# EasyEDA schematic SCH_PDWD-MINI R2_2022-02-19.json

## Sheets
1 PDWD-MINI-SCH_Sheet1_R2: TITLE: PDWD-MINI; REV: 2.0; Date: 2022-02-13; Sheet: 1/2; Drawn By: Dddienst; Company: DienstNet LLC
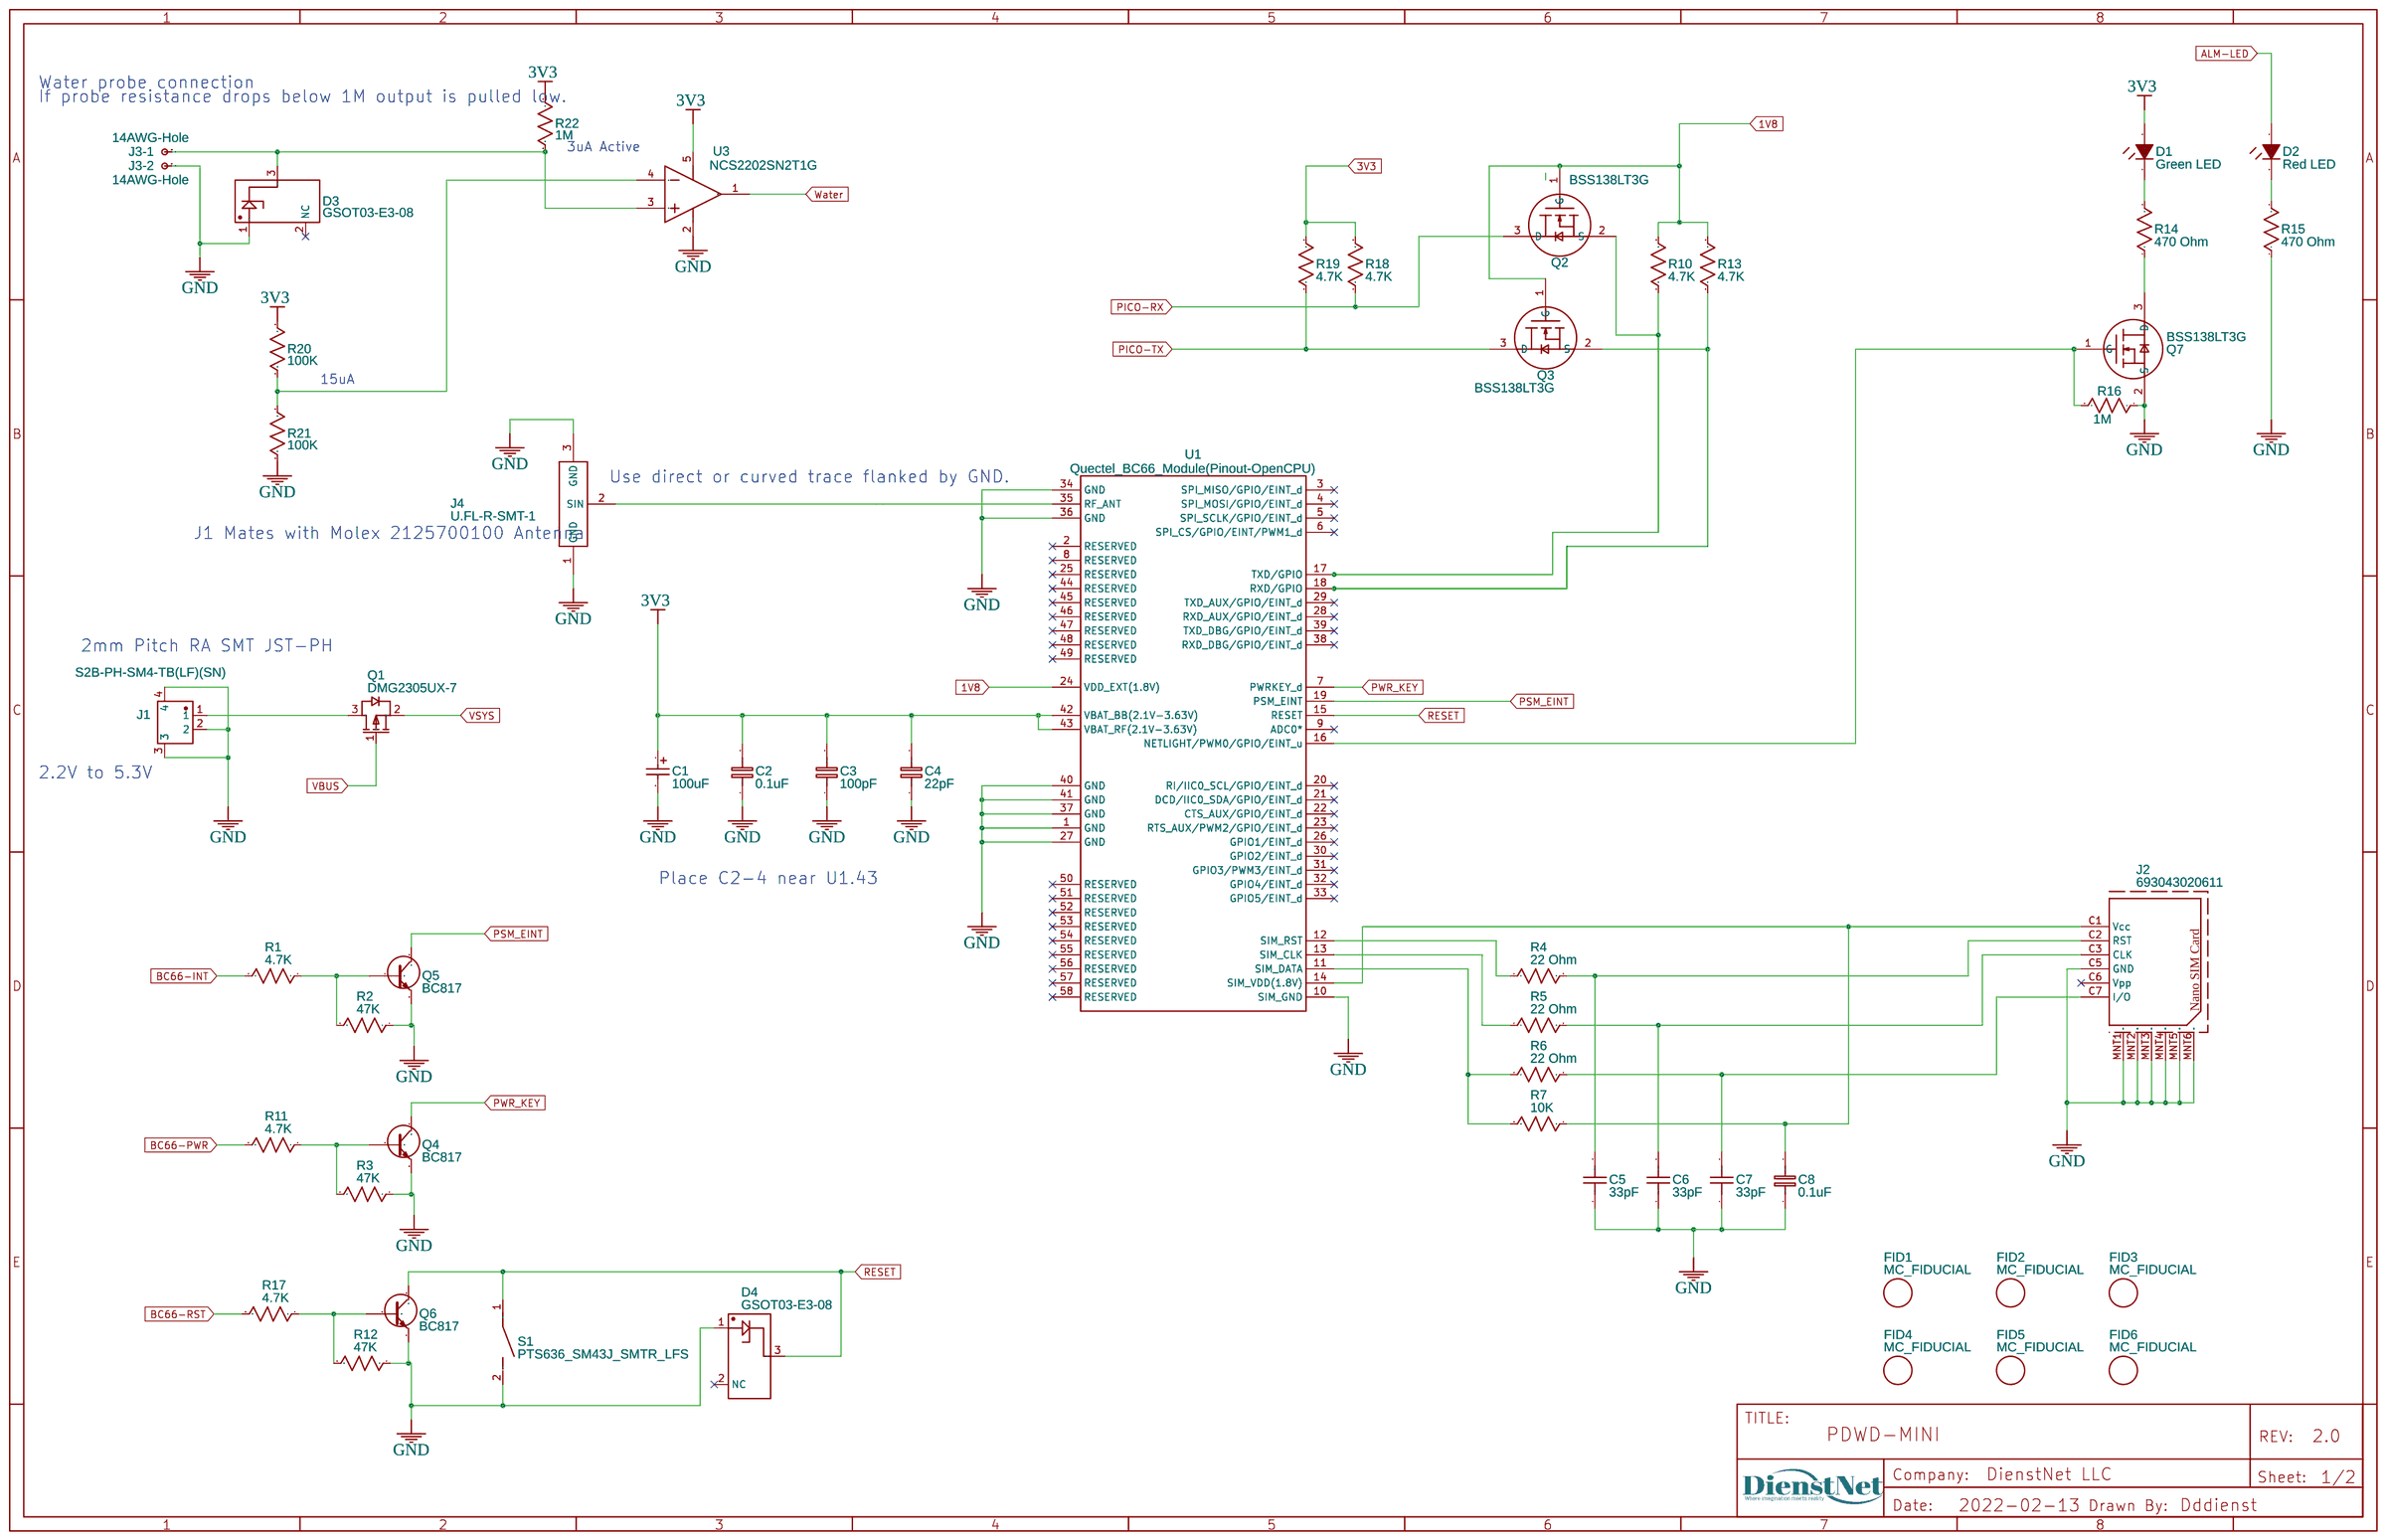
[diagram p0: PDWD-MINI-SCH_Sheet1_R2]
2 PICO_Sheet_2_R2: Sheet: 2/2
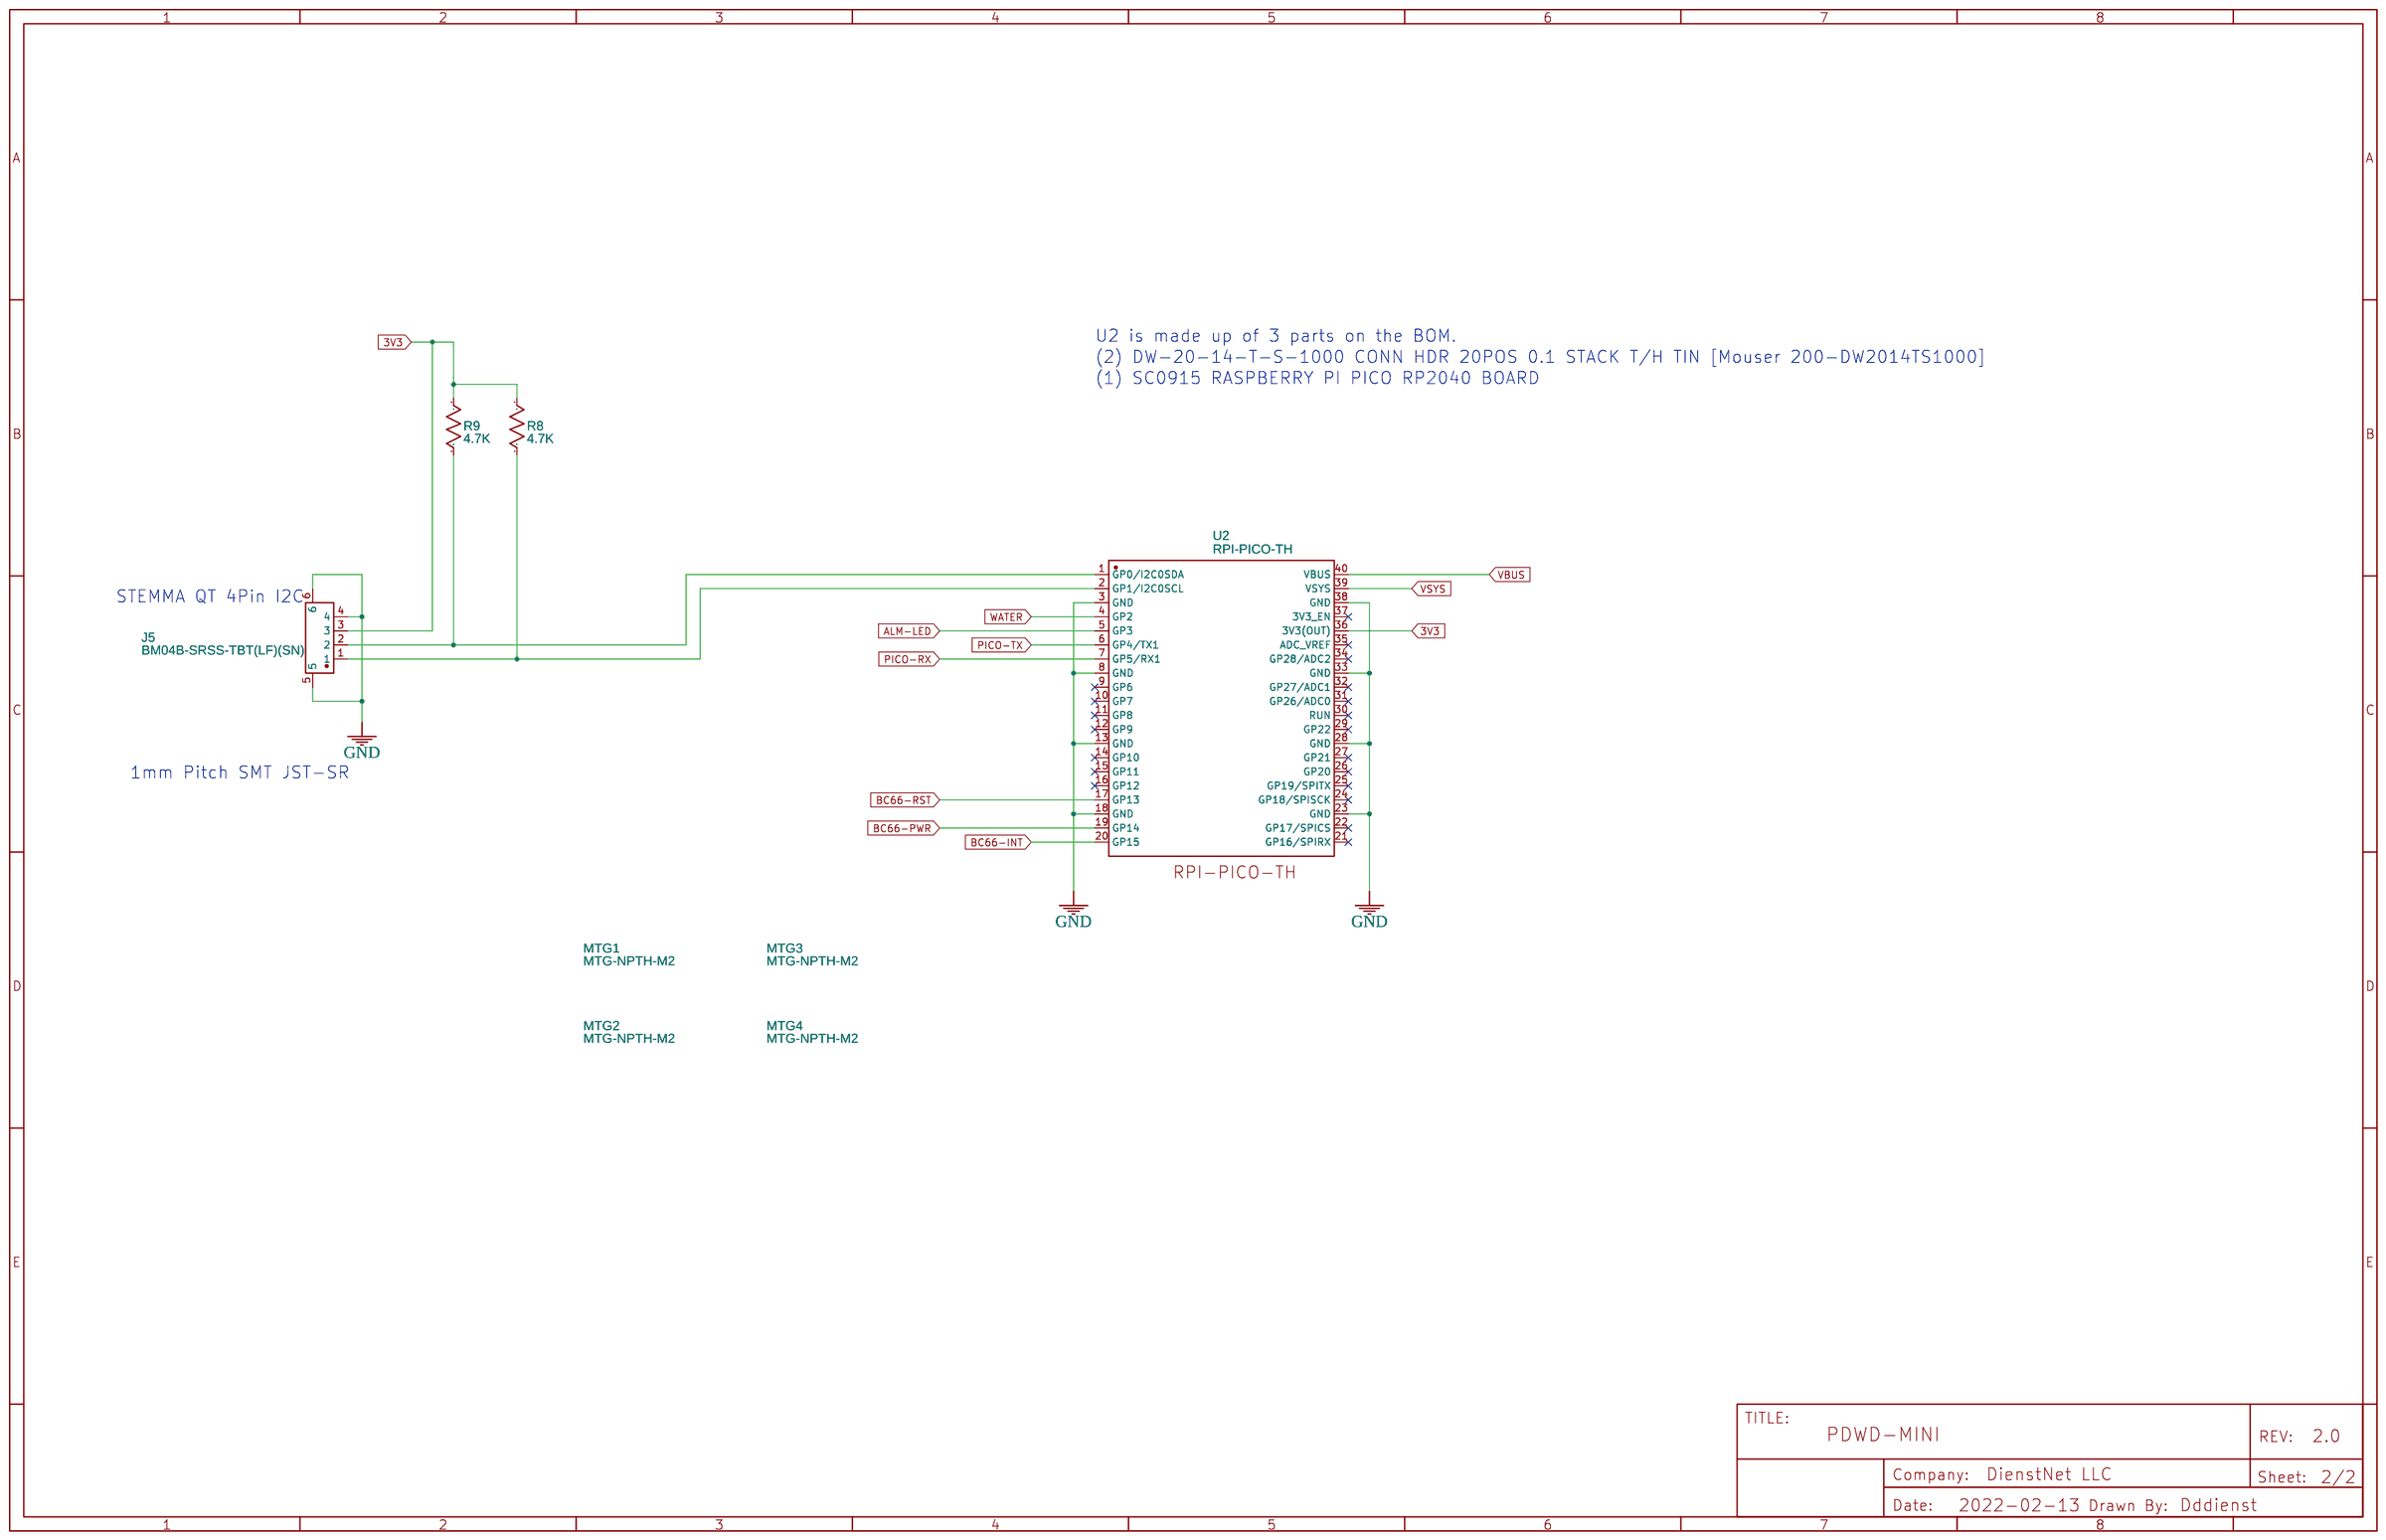
[diagram p1: PICO_Sheet_2_R2]

## Parts
sheet PDWD-MINI-SCH_Sheet1_R2
C1  100uF  [CAP-SMD_L3.2-W1.6-R-RD]
C2  0.1uF  [C0603]
C3  100pF  [C0603]
C4  22pF  [C0603]
C5  33pF  [C0603]
C6  33pF  [C0603]
C7  33pF  [C0603]
C8  0.1uF  [C0603]
D1  Green LED  [SMD DIODE - 0805]
D2  Red LED  [SMD DIODE - 0805]
D3  GSOT03-E3-08  [GSOT03-E3-08]
D4  GSOT03-E3-08  [GSOT03-E3-08]
FID1  MC_FIDUCIAL  [MC_FIDUCIAL]
FID2  MC_FIDUCIAL  [MC_FIDUCIAL]
FID3  MC_FIDUCIAL  [MC_FIDUCIAL]
FID4  MC_FIDUCIAL  [MC_FIDUCIAL]
FID5  MC_FIDUCIAL  [MC_FIDUCIAL]
FID6  MC_FIDUCIAL  [MC_FIDUCIAL]
J1  S2B-PH-SM4-TB(LF)(SN)  [CONN-SMD_P2.00_S2B-PH-SM4-TB-LF-SN]
J2  693043020611  [NANO_SIM_WURTH_693043020611]
J3-1  14AWG-Hole  [14AWG-PAD]
J3-2  14AWG-Hole  [14AWG-PAD]
J4  U.FL-R-SMT-1  [RF-SMD_U.FL-R-SMT-1(80)]
Q1  DMG2305UX-7  [SOT-23-3_L2.9-W1.3-P1.90-LS2.4-BR]
Q2  BSS138LT3G  [SOT-23-3_L2.9-W1.3-P1.90-LS2.4-BR]
Q3  BSS138LT3G  [SOT-23-3_L2.9-W1.3-P1.90-LS2.4-BR]
Q4  BC817  [SOT-23]
Q5  BC817  [SOT-23]
Q6  BC817  [SOT-23]
Q7  BSS138LT3G  [SOT-23-3_L2.9-W1.3-P1.90-LS2.4-BR]
R1  4.7K  [R0603]
R2  47K  [R0603]
R3  47K  [R0603]
R4  22 Ohm  [R0603]
R5  22 Ohm  [R0603]
R6  22 Ohm  [R0603]
R7  10K  [R0603]
R10  4.7K  [R0603]
R11  4.7K  [R0603]
R12  47K  [R0603]
R13  4.7K  [R0603]
R14  470 Ohm  [R0603]
R15  470 Ohm  [R0603]
R16  1M  [R0603]
R17  4.7K  [R0603]
R18  4.7K  [R0603]
R19  4.7K  [R0603]
R20  100K  [R0603]
R21  100K  [R0603]
R22  1M  [R0603]
S1  PTS636_SM43J_SMTR_LFS  [SW_PTS636_SM43J_SMTR_LFS]
U1  Quectel_BC66_Module(Pinout-OpenCPU)  [BC66 PAD DESIGN]
U3  NCS2202SN2T1G  [SOT-23-5_L3.0-W1.7-P0.95-LS2.8-BL]
sheet PICO_Sheet_2_R2
J5  BM04B-SRSS-TBT(LF)(SN)  [CONN-SMD_BM04B-SRSS-TBT-LF-SN]
MTG1  MTG-NPTH-M2  [M2-NPTH]
MTG2  MTG-NPTH-M2  [M2-NPTH]
MTG3  MTG-NPTH-M2  [M2-NPTH]
MTG4  MTG-NPTH-M2  [M2-NPTH]
R8  4.7K  [R0603]
R9  4.7K  [R0603]
U2  RPI-PICO-TH  [RPI-PICO-TH]

## Library data of the parts
C1 = TLJA107M006R0800: Supplier: LCSC; Manufacturer: AVX; Manufacturer Part: TLJA107M006R0500; Supplier Part: C27279; LCSC Assembly: Yes; SMT Type: Extend
C2 C8 = C_0603_EU: Supplier Part: C1591; Supplier: LCSC; Contributor: LCEDA_Lib; Manufacturer Part: 06036C104JAT2A; Manufacturer: AVX
C3 = C_0603_EU: Supplier Part: C62768; Supplier: LCSC; Contributor: LCEDA_Lib; Manufacturer Part: CC0603KRX7R7BB101; Manufacturer: YAGEO
C4 = C_0603_EU: Supplier Part: C91183; Supplier: LCSC; Contributor: LCEDA_Lib; Manufacturer Part: CC0603JRX7R9BB104; Manufacturer: YAGEO
C5-C7 = C_0805_US: Supplier Part: C599724; Supplier: LCSC; Contributor: LCEDA_Lib; Manufacturer Part: C0603C330J5GACTU; Manufacturer: KEMET
D1 = Red LED - SMD: Supplier: Mouser; Manufacturer: Bivar; Manufacturer Part: SM0805GCL; Supplier Part: 749-SM0805GCL; LCSC Assembly: Yes; SMT Type: Basic; link: https://www.mouser.com/ProductDetail/Bivar/R3HC?qs=sGAEpiMZZMtmwHDZQCdlqcUYq%2FyMhwx0%252BbDq1FMkavE%3D; Contributor: Empire Engineering
D2 = Red LED - SMD: Supplier: Mouser; Manufacturer: Bivar; Manufacturer Part: SM0805HCL; Supplier Part: 749-SM0805HCL; LCSC Assembly: Yes; SMT Type: Basic; link: https://www.mouser.com/ProductDetail/Bivar/R3HC?qs=sGAEpiMZZMtmwHDZQCdlqcUYq%2FyMhwx0%252BbDq1FMkavE%3D; Contributor: Empire Engineering
D3 D4 = GSOT03-E3-08: Supplier: LCSC; Manufacturer: Vishay; Contributor: fan4dry4
FID1-FID6 = MC_FIDUCIAL: Contributor: LieBtrau; Mounted: No
J1 = S2B-PH-SM4-TB(LF)(SN): Supplier: LCSC; Supplier Part: C295747; Manufacturer: JST Sales America; Contributor: LCSC; JLCPCB Part Class: Extended Part
J2 = 693043020611: Supplier Part: 732-5954-1-ND; Supplier: Digi-Key; Manufacturer: Wurth Electronics; Contributor: Tehseen
J3-1 J3-2 = 14AWG-Hole: Contributor: keempen
J4 = U.FL-R-SMT-1(80): Supplier: LCSC; Manufacturer: HRS; Supplier Part: C88374
Q1 = DMG2305UX-7: Supplier: LCSC; Supplier Part: C150470; Manufacturer: Diodes Incorporated; Contributor: LCSC; JLCPCB Part Class: Extended Part; Package Display: No
Q2 Q3 Q7 = BSS138LT3G: Supplier: LCSC; Manufacturer: ON; Contributor: LCSC; Supplier Part: C83790; SMT Type: Extend; JLCPCB SMD: Yes; LCSC Assembly: Yes
Q4-Q6 = BC817: Contributor: AndyS74; Supplier Part: C94373; Supplier: LCSC; Manufacturer Part: BC817-16LT1G; Manufacturer: ON Semiconductor
R1 R8-R11 R13 R17-R19 = R_0805_US: Supplier Part: C278641; Supplier: LCSC; Contributor: LCEDA_Lib; Manufacturer Part: ERJ-3GEYJ472V; Manufacturer: Panasonic
R2 R3 R12 = R_0805_US: Supplier Part: C427281; Supplier: LCSC; Contributor: LCEDA_Lib; Manufacturer Part: ERJ-3GEYJ473V; Manufacturer: Panasonic
R4-R6 = R_0805_US: Supplier Part: C278638; Supplier: LCSC; Contributor: LCEDA_Lib; Manufacturer Part: ERJ-3GEYJ220V; Manufacturer: Panasonic
R7 = R_0805_US: Supplier Part: C169849; Supplier: LCSC; Contributor: LCEDA_Lib; Manufacturer Part: ERJ-3GEYJ103V; Manufacturer: Panasonic
R14 R15 = R_0805_US: Supplier Part: C169852; Supplier: LCSC; Contributor: LCEDA_Lib; Manufacturer Part: ERJ-3GEYJ471V; Manufacturer: Panasonic
R16 R22 = R_0805_US: Supplier Part: C278634; Supplier: LCSC; Contributor: LCEDA_Lib; Manufacturer Part: ERJ-3GEYJ105V; Manufacturer: Panasonic
R20 R21 = R_0805_US: Supplier Part: C427284; Supplier: LCSC; Contributor: LCEDA_Lib; Manufacturer Part: ERJ-3GEYJ104V; Manufacturer: Panasonic
S1 = PTS636_SM43J_SMTR_LFS: Contributor: ZegesMenden; Manufacturer Part: PTS636 SM43J SMTR LFS; Supplier: Mouser; Manufacturer: C&K; Supplier Part: 611-PTS636SM43JSMTRL
U1 = Quectel_BC66_Module(Pinout-OpenCPU): Manufacturer: QUECTEL; Manufacturer Part: BC66NB-04-STD; Supplier Part: 277-BC66NB-04-STD; Supplier: Mouser; link: https://www.quectel.com/product/bc66.htm; Contributor: jonrietveld98
U3 = NCS2202SN2T1G: Supplier: LCSC; Manufacturer: ON; Supplier Part: C94396; SMT Type: Extend; JLCPCB SMD: Yes; LCSC Assembly: Yes
J5 = BM04B-SRSS-TBT(LF)(SN): Supplier: LCSC; Supplier Part: C495539; Manufacturer: JST Sales America; Contributor: LCSC; JLCPCB Part Class: Extended Part
MTG1-MTG4 = MTG-NPTH-M2: Contributor: VivosLespagnos
U2 = RPI-PICO-TH: Manufacturer: Raspberry Pi; Manufacturer Part: SC0915; Supplier Part: 2648-SC0915CT-ND; Supplier: Digi-Key; Contributor: Dddienst; Package Display: No

## Nets
1V8: Q2.1(G) Q3.1(G) R10.2 R13.2 U1.24(VDD_EXT(1.8V))
3V3: C1.1 C2.2 C3.2 C4.2 D1.1(A) J5.3 R8.2 R9.2 R18.2 R19.2 R20.1 R22.1 U1.42(VBAT_BB(2.1V-3.63V)) U1.43(VBAT_RF(2.1V-3.63V)) U2.36(3V3(OUT)) U3.5(+V)
GND: C1.2 C2.1 C3.1 C4.1 C5.1 C6.1 C7.1 C8.1 D3.1(IN) D4.1(IN) J1.2 J1.3 J1.4 J2.C5(GND) J2.MNT1(Shield) J2.MNT2(Shield) J2.MNT3(Shield) J2.MNT4(Shield) J2.MNT5(Shield) J2.MNT6(Shield) J3-2.P$1 J4.1(GND) J4.3(GND) J5.4 J5.5 J5.6 Q4.2(E) Q5.2(E) Q6.2(E) Q7.2(S) R2.1 R3.1 R12.1 R15.1 R16.1 R21.2 S1.2(NO) U1.1(GND) U1.10(SIM_GND) U1.27(GND) U1.34(GND) U1.36(GND) U1.37(GND) U1.40(GND) U1.41(GND) U2.3(GND) U2.8(GND) U2.13(GND) U2.18(GND) U2.23(GND) U2.28(GND) U2.33(GND) U2.38(GND) U3.2(-V)
VBUS: Q1.1(G) U2.40(VBUS)
ALM-LED: D2.1(A) U2.5(GP3)
BC66-INT: R1.2 U2.20(GP15)
BC66-PWR: R11.2 U2.19(GP14)
BC66-RST: R17.2 U2.17(GP13)
PICO-RX: Q2.3(D) R18.1 U2.7(GP5/RX1)
PICO-TX: Q3.3(D) R19.1 U2.6(GP4/TX1)
PSM_EINT: Q5.3(C) U1.19(PSM_EINT)
PWR_KEY: Q4.3(C) U1.7(PWRKEY_d)
RESET: D4.3(OUT) Q6.3(C) S1.1(COM) U1.15(RESET)
VSYS: Q1.2(S) U2.39(VSYS)
Water: U3.1(OUT)
WATER: U2.4(GP2)
Net-(C5-2): C5.2 J2.C2(RST) R4.2
Net-(C6-2): C6.2 J2.C3(CLK) R5.2
Net-(C7-2): C7.2 J2.C7(I/O) R6.2
Net-(C8-2): C8.2 J2.C1(Vcc) R7.1 U1.14(SIM_VDD(1.8V))
Net-(D1-2): D1.2(K) R14.2
Net-(D2-2): D2.2(K) R15.2
Net-(D3-3): D3.3(OUT) J3-1.P$1 R22.2 U3.3(+IN)
Net-(J1-1): J1.1 Q1.3(D)
Net-(J4-2): J4.2(SIN) U1.35(RF_ANT)
Net-(J5-1): J5.1 R8.1 U2.2(GP1/I2C0SCL)
Net-(J5-2): J5.2 R9.1 U2.1(GP0/I2C0SDA)
Net-(Q2-2): Q2.2(S) R10.1 U1.17(TXD/GPIO)
Net-(Q3-2): Q3.2(S) R13.1 U1.18(RXD/GPIO)
Net-(Q4-1): Q4.1(B) R3.2 R11.1
Net-(Q5-1): Q5.1(B) R1.1 R2.2
Net-(Q6-1): Q6.1(B) R12.2 R17.1
Net-(Q7-1): Q7.1(G) R16.2 U1.16(NETLIGHT/PWM0/GPIO/EINT_u)
Net-(Q7-3): Q7.3(D) R14.1
Net-(R4-1): R4.1 U1.12(SIM_RST)
Net-(R5-1): R5.1 U1.13(SIM_CLK)
Net-(R6-1): R6.1 R7.2 U1.11(SIM_DATA)
Net-(R20-2): R20.2 R21.1 U3.4(-IN)

Not connected (* = marked no-connect by the designer): D3 2(NC)*; D4 2(NC)*; J2 C6(Vpp)*; U1 2(RESERVED)* 3(SPI_MISO/GPIO/EINT_d)* 4(SPI_MOSI/GPIO/EINT_d)* 5(SPI_SCLK/GPIO/EINT_d)* 6(SPI_CS/GPIO/EINT/PWM1_d)* 8(RESERVED)* 9(ADC0*)* 20(RI/IIC0_SCL/GPIO/EINT_d)* 21(DCD/IIC0_SDA/GPIO/EINT_d)* 22(CTS_AUX/GPIO/EINT_d)* 23(RTS_AUX/PWM2/GPIO/EINT_d)* 25(RESERVED)* 26(GPIO1/EINT_d)* 28(RXD_AUX/GPIO/EINT_d)* 29(TXD_AUX/GPIO/EINT_d)* 30(GPIO2/EINT_d)* 31(GPIO3/PWM3/EINT_d)* 32(GPIO4/EINT_d)* 33(GPIO5/EINT_d)* 38(RXD_DBG/GPIO/EINT_d)* 39(TXD_DBG/GPIO/EINT_d)* 44(RESERVED)* 45(RESERVED)* 46(RESERVED)* 47(RESERVED)* 48(RESERVED)* 49(RESERVED)* 50(RESERVED)* 51(RESERVED)* 52(RESERVED)* 53(RESERVED)* 54(RESERVED)* 55(RESERVED)* 56(RESERVED)* 57(RESERVED)* 58(RESERVED)*; U2 9(GP6)* 10(GP7)* 11(GP8)* 12(GP9)* 14(GP10)* 15(GP11)* 16(GP12)* 21(GP16/SPIRX)* 22(GP17/SPICS)* 24(GP18/SPISCK)* 25(GP19/SPITX)* 26(GP20)* 27(GP21)* 29(GP22)* 30(RUN)* 31(GP26/ADC0)* 32(GP27/ADC1)* 34(GP28/ADC2)* 35(ADC_VREF)* 37(3V3_EN)*

## Notes on the sheets
sheet 1
- Water probe connection
- If probe resistance drops below 1M output is pulled low.
- 3uA Active
- 15uA
- Use direct or curved trace flanked by GND.
- J1 Mates with Molex 2125700100 Antenna
- 2mm Pitch RA SMT JST-PH
- 2.2V to 5.3V
- Place C2-4 near U1.43
sheet 2
- U2 is made up of 3 parts on the BOM.
- (2) DW-20-14-T-S-1000 CONN HDR 20POS 0.1 STACK T/H TIN [Mouser 200-DW2014TS1000]
- (1) SC0915 RASPBERRY PI PICO RP2040 BOARD
- STEMMA QT 4Pin I2C
- 1mm Pitch SMT JST-SR
